# EAGLE design anna-b112-to-dip (EAGLE 9.4.2)
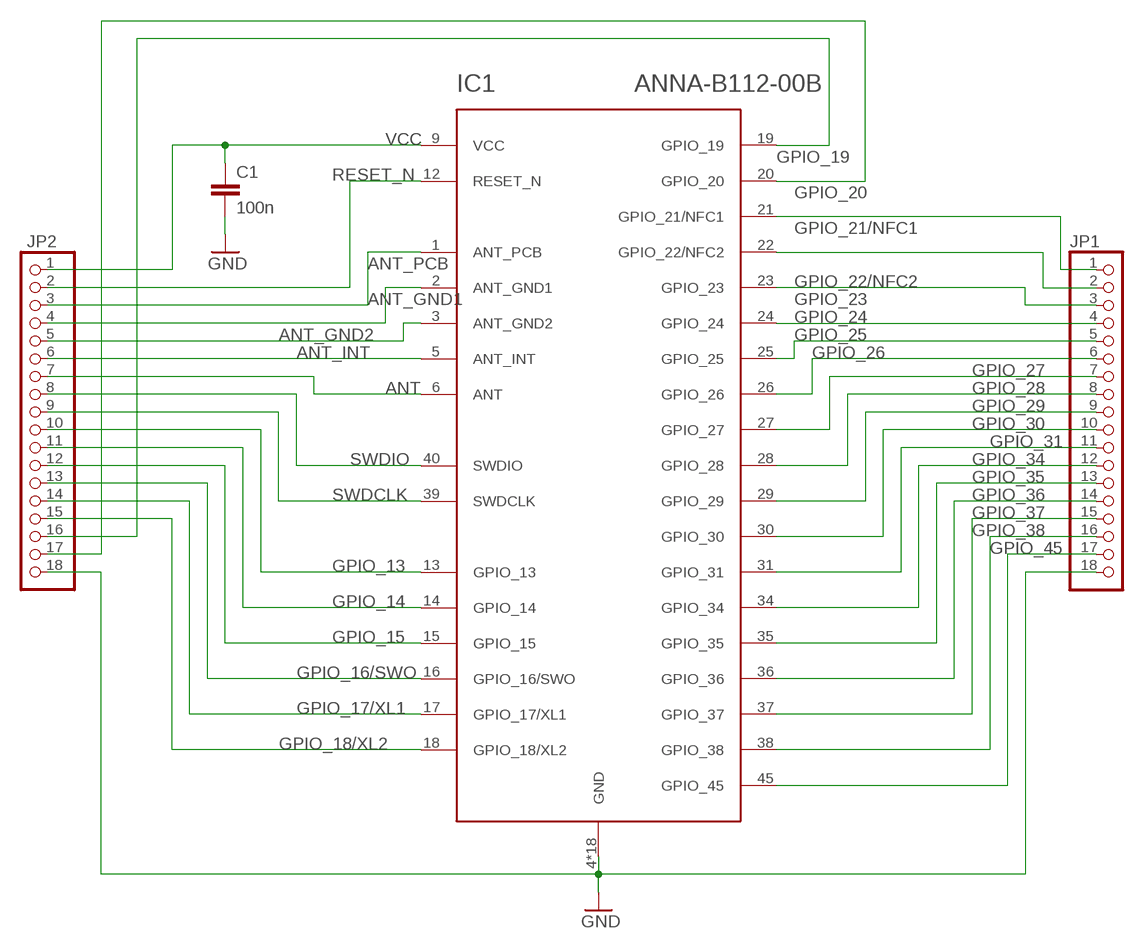
[diagram p0: schematic, sheet 1]

## Parts
C1  100n  C-EUC0805  [C0805]
IC1  ANNA-B112-00B  [ANNA-B112]
JP1  PINHD-1X18  [1X18]
JP2  PINHD-1X18  [1X18]

## Nets
ANT: IC1.6(ANT) JP2.7
ANT_GND1: IC1.2(ANT_GND1) JP2.4
ANT_GND2: IC1.3(ANT_GND2) JP2.5
ANT_INT: IC1.5(ANT_INT) JP2.6
ANT_PCB: IC1.1(ANT_PCB) JP2.3
GND: C1.2 IC1.4(GND) IC1.7(GND) IC1.8(GND) IC1.10(GND) IC1.11(GND) IC1.32(GND) IC1.33(GND) IC1.41(GND) IC1.42(GND) IC1.43(GND) IC1.44(GND) IC1.46(GND) IC1.47(GND) IC1.48(GND) IC1.49(GND) IC1.50(GND) IC1.51(GND) IC1.52(GND) JP1.18 JP2.18
GPIO_13: IC1.13(GPIO_13) JP2.10
GPIO_14: IC1.14(GPIO_14) JP2.11
GPIO_15: IC1.15(GPIO_15) JP2.12
GPIO_16/SWO: IC1.16(GPIO_16/SWO) JP2.13
GPIO_17/XL1: IC1.17(GPIO_17/XL1) JP2.14
GPIO_18/XL2: IC1.18(GPIO_18/XL2) JP2.15
GPIO_19: IC1.19(GPIO_19) JP2.16
GPIO_20: IC1.20(GPIO_20) JP2.17
GPIO_21/NFC1: IC1.21(GPIO_21/NFC1) JP1.1
GPIO_22/NFC2: IC1.22(GPIO_22/NFC2) JP1.2
GPIO_23: IC1.23(GPIO_23) JP1.3
GPIO_24: IC1.24(GPIO_24) JP1.4
GPIO_25: IC1.25(GPIO_25) JP1.5
GPIO_26: IC1.26(GPIO_26) JP1.6
GPIO_27: IC1.27(GPIO_27) JP1.7
GPIO_28: IC1.28(GPIO_28) JP1.8
GPIO_29: IC1.29(GPIO_29) JP1.9
GPIO_30: IC1.30(GPIO_30) JP1.10
GPIO_31: IC1.31(GPIO_31) JP1.11
GPIO_34: IC1.34(GPIO_34) JP1.12
GPIO_35: IC1.35(GPIO_35) JP1.13
GPIO_36: IC1.36(GPIO_36) JP1.14
GPIO_37: IC1.37(GPIO_37) JP1.15
GPIO_38: IC1.38(GPIO_38) JP1.16
GPIO_45: IC1.45(GPIO_45) JP1.17
RESET_N: IC1.12(RESET_N) JP2.2
SWDCLK: IC1.39(SWDCLK) JP2.9
SWDIO: IC1.40(SWDIO) JP2.8
VCC: C1.1 IC1.9(VCC) JP2.1

## Library data of the parts
C1 = resistor:C-EU: CAPACITOR, European symbol
IC1 = custom-library:ANNA-B112-00B: u-blox ANNA-B112-00B
JP1 JP2 = pinhead:PINHD-1X18: PIN HEADER

## Board
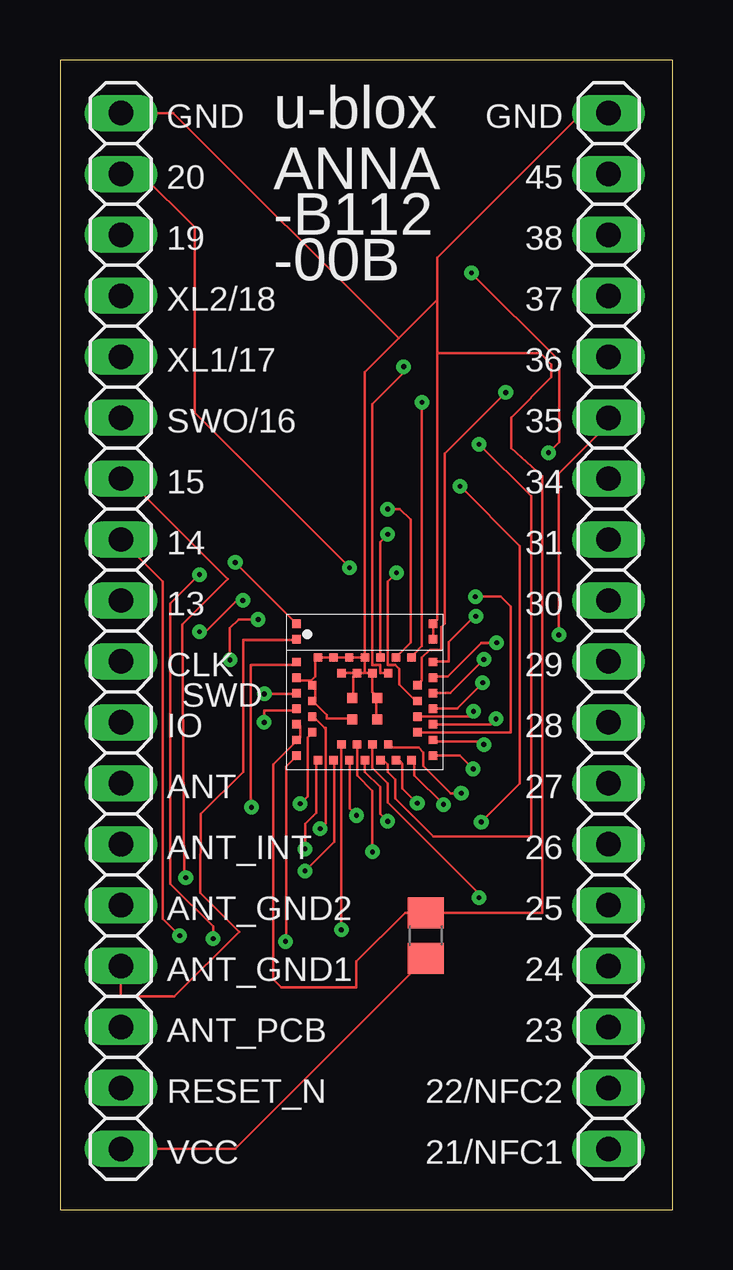
[diagram p1: board, top side]
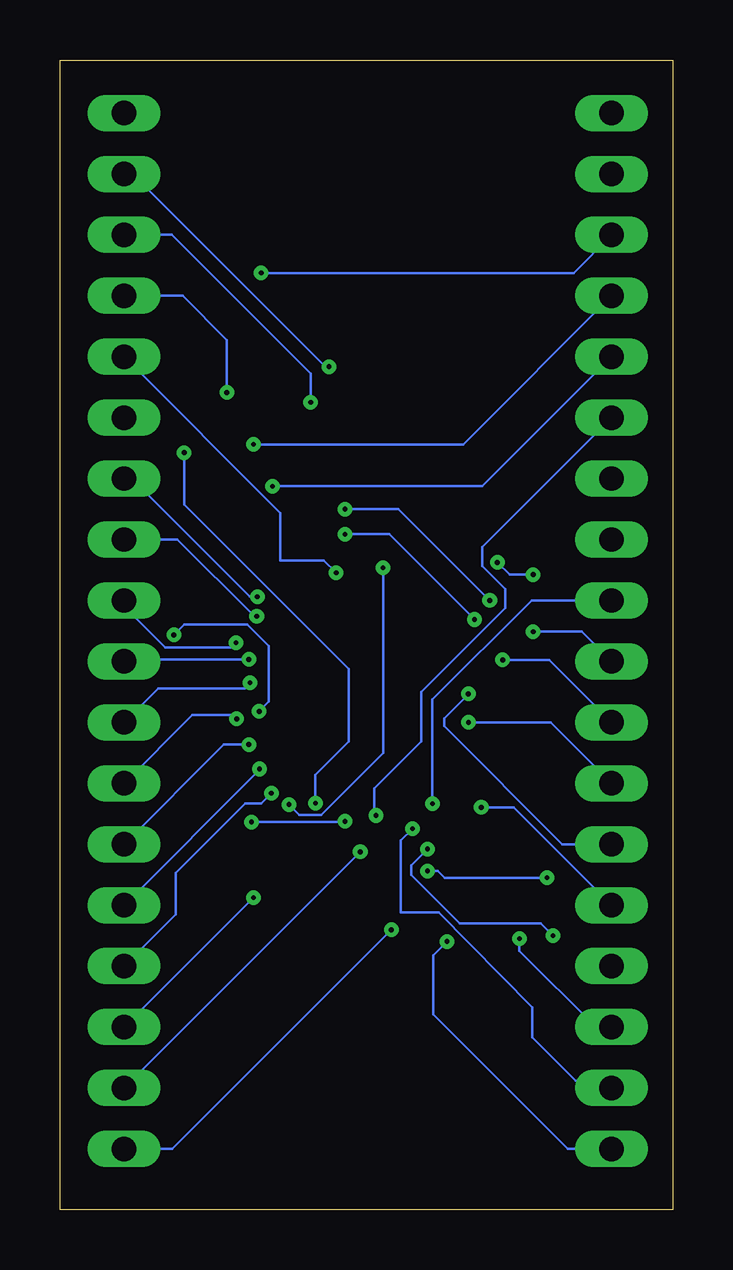
[diagram p2: board, bottom side, seen from below]

Size 25.53 x 47.93 mm. Coordinates in mm from the lower left corner, seen from the top.
Outline: 0,0 25.53,0 25.53,47.93 0,47.93 0,0
Copper layers (1*16): Top 0.035mm / dielectric 1.5mm / Bottom 0.035mm
Design rules "default *": minimum track width 4mil, minimum drill 0.2mm, track to track 6mil, track to pad 3mil, pad to pad 6mil, via to via 6mil, smd to smd 6mil, copper to edge 40mil, drill to drill 4mil, minimum pad ring 10mil, minimum via ring 8mil, stop-mask expansion 4mil, vias tented up to drill 0mil, thermal gap 10mil

### Footprints (pad centres in the part's own frame; a part is rotated, then mirrored left to right if it is on the bottom)
C0805 = smd 1.3 x 1.5: 1 -0.95,0; 2 0.95,0
ANNA-B112 = smd 0.35 x 0.35: 1 -2.84,2.84; 2 -2.84,2.19; 3 -2.84,1.248; 4 -2.84,0.598; 5 -2.84,-0.052; 6 -2.84,-0.702; 7 -2.84,-1.352; 8 -2.84,-2.002; 9 -2.84,-2.652; 10 -2.19,0.273; 11 -2.19,-0.377; 12 -2.19,-1.027; 13 -2.19,-1.677; 14 -1.95,-2.84; 15 -1.3,-2.84; 16 -0.65,-2.84; 17 0,-2.84; 18 0.65,-2.84; 19 1.3,-2.84; 20 1.95,-2.84; 21 -0.975,-2.19; 22 -0.325,-2.19; 23 0.325,-2.19; 24 0.975,-2.19; 25 2.84,-2.652; 26 2.84,-2.002; 27 2.84,-1.352; 28 2.84,-0.702; 29 2.84,-0.052; 30 2.84,0.598; 31 2.84,1.248; 32 2.84,2.19; 33 2.84,2.84; 34 2.19,-1.677; 35 2.19,-1.027; 36 2.19,-0.377; 37 2.19,0.273; 38 1.95,1.435; 39 1.3,1.435; 40 0.65,1.435; 41 0,1.435; 42 -0.65,1.435; 43 -1.3,1.435; 44 -1.95,1.435; 45 0.975,0.785; 46 0.325,0.785; 47 -0.325,0.785; 48 -0.975,0.785 | smd 0.42 x 0.42: 49 -0.52,-0.252; 50 -0.52,-1.152; 51 0.52,-1.152; 52 0.52,-0.252
1X18 = drill 1.016 long: 1 -21.59,0; 2 -19.05,0; 3 -16.51,0; 4 -13.97,0; 5 -11.43,0; 6 -8.89,0; 7 -6.35,0; 8 -3.81,0; 9 -1.27,0; 10 1.27,0; 11 3.81,0; 12 6.35,0; 13 8.89,0; 14 11.43,0; 15 13.97,0; 16 16.51,0; 17 19.05,0; 18 21.59,0

### Placement (x,y rotation side)
C1  15.24,11.43 90 top
IC1  12.7,21.59 0 top
JP1  22.86,24.13 90 top
JP2  2.54,24.13 90 top

### Tracks (layer width: path | path; a pad name or v marks a point on that pad's centre or on a via)
ANT  (via drill 0.2)
  Top 0.102: v8.51,20.32 8.51,20.82 9.85,20.82 IC1.6
  Bottom 0.102: v8.51,20.32 5.08,20.32 JP2.7
ANT_GND1
  Top 0.102: IC1.2 9.84,23.75 7.63,23.75 7.63,18.26 5.87,16.51 5.84,13.21 7.46,11.59 4.76,8.89 2.54,8.89 JP2.4
ANT_GND2  (via drill 0.2)
  Top 0.102: v7.98,16.78 7.95,16.8 7.95,22.7 9.84,22.7 IC1.3
  Bottom 0.102: v7.98,16.78 6.62,16.78 JP2.5
ANT_INT  (via drill 0.2)
  Top 0.102: v8.52,21.51 9.86,21.51 IC1.5
  Bottom 0.102: v8.52,21.51 8.51,21.5 9.53,20.48 9.53,20.16 4.6,15.24 JP2.6
ANT_PCB  (via drill 0.2)
  Top 0.102: v7.3,26.99 IC1.1 | v5.81,26.48 4.6,25.27 4.6,13.59 6.38,11.81 v6.38,11.3
  Bottom 0.102: v7.3,26.99 6.79,26.48 v5.81,26.48 | v6.38,11.3 6.38,10.79 3.21,7.62 JP2.3
GND
  Top 0.102: IC1.7 10,20.16 10,19.68 IC1.8 9.84,19.53 8.89,18.57 8.89,9.61 9.21,9.28 12.35,9.28 12.35,10.35 14.38,12.38 C1.2 20.1,12.38 20.1,30.59 18.8,31.75 18.8,33.02 20.48,34.7 20.48,35.24 20,35.72 15.72,35.72 | 10.48,22.07 10,22.07 IC1.4 | 10.48,22.07 10.48,21.91 IC1.10 10.64,21.75 10.64,21.27 IC1.11 10.64,21.11 11.11,20.64 11.11,20.48 12.06,20.48 IC1.50 | IC1.41 12.06,23.02 IC1.42 11.91,23.02 11.43,23.02 IC1.43 11.27,23.02 10.79,23.02 IC1.44 10.64,23.02 10.64,22.23 10.48,22.07 | IC1.51 13.18,20.48 13.18,21.27 IC1.52 13.18,21.43 13.02,21.59 13.02,22.23 IC1.46 12.7,22.38 | IC1.48 11.75,22.38 12.22,22.38 IC1.47 | 12.7,22.38 IC1.47 | IC1.49 12.22,21.43 12.22,22.23 IC1.47 | 12.7,22.38 IC1.41 | IC1.41 12.7,34.92 14.11,36.34 | IC1.32 15.56,23.81 15.56,24.29 IC1.33 15.72,24.61 15.72,35.72 | 15.72,37.94 15.72,39.69 21.74,45.72 JP1.18 | 15.72,37.94 15.72,35.72 | 15.72,37.94 14.11,36.34 | 14.11,36.34 4.72,45.72 JP2.18
GPIO_13  (via drill 0.2)
  Top 0.102: v10.01,16.93 10.32,17.24 10.32,19.68 10.48,19.84 IC1.13
  Bottom 0.102: v10.01,16.93 10.01,21.27 5.87,25.4 JP2.10
GPIO_14  (via drill 0.2)
  Top 0.102: IC1.14 10.67,18.67 10.67,16.54 10.21,16.09 v10.21,15.04 | v4.99,11.43 4.29,12.13 4.29,26.19 JP2.11
  Bottom 0.102: v10.21,15.04 10.9,14.36 10.9,13.96 8.87,11.94 5.49,11.94 v4.99,11.43
GPIO_15  (via drill 0.2)
  Top 0.102: v10.21,14.12 11.43,15.34 11.43,18.73 IC1.15 | v5.24,13.84 5.17,13.91 5.09,24.4 6.99,26.29 2.79,30.48 JP2.12
  Bottom 0.102: v10.21,14.12 9.78,14.12 9.5,13.84 v5.24,13.84
GPIO_16/SWO  (via drill 0.2)
  Top 0.102: v12.36,16.44 12.06,16.73 12.06,18.73 IC1.16
  Bottom 0.102: v12.36,16.44 12.43,16.52 12.43,17.57 10.48,19.53 10.48,21.59 6.99,25.08 6.99,25.88 7.94,26.83 7.94,27.62 JP2.13
GPIO_17/XL1  (via drill 0.2)
  Top 0.102: IC1.17 12.7,18.26 13.34,17.62 13.34,16.51 v13.65,16.19 | v17.55,16.17 19.16,17.77 19.16,27.67 v16.67,30.16
  Bottom 0.102: v17.55,16.17 13.68,16.17 v13.65,16.19 | v16.67,30.16 7.94,30.16 JP2.14
GPIO_18/XL2  (via drill 0.2)
  Top 0.102: v17.46,31.91 19.63,29.74 19.63,15.56 15.56,15.56 13.97,17.14 13.97,17.94 13.65,18.26 13.65,18.57 13.49,18.73 IC1.18
  Bottom 0.102: v17.46,31.91 8.73,31.91 JP2.15
GPIO_19  (via drill 0.2)
  Top 0.102: v14.88,16.95 14.27,17.56 14.27,18.59 14.13,18.73 IC1.19 | v20.35,31.56 20.8,32 20.8,35.4 v17.14,39.05
  Bottom 0.102: v14.88,16.95 14.88,18.14 13.49,19.53 13.49,22.54 20.35,29.4 v20.35,31.56 | v17.14,39.05 4.13,39.05 JP2.16
GPIO_20  (via drill 0.2)
  Top 0.102: v15.98,16.9 14.76,18.12 14.76,18.73 IC1.20 | v12.06,26.77 5.61,33.22 5.61,40.95 3.38,43.18 JP2.17
  Bottom 0.102: v15.98,16.9 15.55,16.47 14.65,16.47 12.06,19.05 v12.06,26.77
GPIO_21/NFC1  (via drill 0.2)
  Top 0.102: IC1.21 v11.72,11.67
  Bottom 0.102: JP1.1 20.85,2.54 v11.72,11.67
GPIO_22/NFC2  (via drill 0.2)
  Top 0.102: v13.02,14.92 13.02,17.46 12.38,18.1 12.38,19.37 IC1.22
  Bottom 0.102: JP1.2 v13.02,14.92
GPIO_23  (via drill 0.2)
  Top 0.102: v17.46,13.02 17.46,13.18 13.65,16.99 13.65,17.78 13.02,18.41 13.02,19.37 IC1.23
  Bottom 0.102: JP1.3 v17.46,13.02
GPIO_24  (via drill 0.2)
  Top 0.102: IC1.24 13.8,19.27 14.95,19.27 15.14,19.07 15.14,18.51 16.29,17.37 v16.72,17.37
  Bottom 0.102: v16.72,17.37 17.15,16.93 17.8,16.93 20.7,14.04 20.7,12.32 JP1.4
GPIO_25  (via drill 0.2)
  Top 0.102: v17.21,18.38 16.65,18.94 IC1.25
  Bottom 0.102: v17.21,18.38 17.21,18.34 JP1.5
GPIO_26  (via drill 0.2)
  Top 0.102: v17.66,19.39 17.66,19.53 15.56,19.53 IC1.26
  Bottom 0.102: v17.66,19.39 18.71,19.39 JP1.6
GPIO_27  (via drill 0.2)
  Top 0.102: v18.17,20.47 17.94,20.24 IC1.27
  Bottom 0.102: v18.17,20.47 18.32,20.62 20.02,20.62 JP1.7
GPIO_28  (via drill 0.2)
  Top 0.102: v17.61,21.97 16.54,20.9 15.59,20.9 15.56,20.91 IC1.28
  Bottom 0.102: v17.61,21.97 17.84,21.74 21.44,21.74 JP1.8
GPIO_29  (via drill 0.2)
  Top 0.102: v17.66,22.94 16.26,21.55 16.26,21.54 IC1.29
  Bottom 0.102: JP1.9 22.78,22.94 v17.66,22.94
GPIO_30  (via drill 0.2)
  Top 0.102: v18.19,23.64 17.56,23.64 16.15,22.23 15.56,22.23 IC1.30
  Bottom 0.102: v18.19,23.64 18.4,23.43 21.14,23.43 22.86,25.15 JP1.10
GPIO_31  (via drill 0.2)
  Top 0.102: v17.33,24.75 17.28,24.75 16.19,23.66 16.19,22.86 15.56,22.86 IC1.31
  Bottom 0.102: v17.33,24.75 17.44,24.75 20.64,27.94 JP1.11
GPIO_34  (via drill 0.2)
  Top 0.102: v17.3,25.56 18.37,25.56 18.78,25.15 18.78,19.9 IC1.34
  Bottom 0.102: v17.3,25.56 17.62,25.56 22.54,30.48 JP1.12
GPIO_35  (via drill 0.2)
  Top 0.102: v17.23,20.78 17.02,20.57 14.9,20.57 IC1.35 | v20.78,23.96 20.78,30.69 22.86,32.77 JP1.13
  Bottom 0.102: v17.23,20.78 16.82,21.18 16.82,23.5 17.72,24.4 20.35,24.4 v20.78,23.96
GPIO_36  (via drill 0.2)
  Top 0.102: v14.02,26.56 13.65,26.19 13.65,22.7 13.97,22.7 14.13,22.54 14.13,21.91 14.76,21.27 IC1.36
  Bottom 0.102: v14.02,26.56 14.53,27.06 16.35,27.06 16.35,29.05 JP1.14
GPIO_37  (via drill 0.2)
  Top 0.102: v18.57,34.07 16.03,31.53 16.03,24.45 15.88,24.29 15.88,23.34 15.4,23.34 15.08,23.02 15.08,22.07 14.92,21.91 IC1.37
  Bottom 0.102: JP1.15 20.42,38.1 18.57,36.25 v18.57,34.07
GPIO_38  (via drill 0.2)
  Top 0.102: v15.08,33.66 15.08,23.5 14.76,23.18 IC1.38
  Bottom 0.102: v15.08,33.66 15.08,34.85 20.87,40.64 JP1.16
GPIO_45  (via drill 0.2)
  Top 0.102: v14.32,35.15 14.32,34.89 13.02,33.59 13.02,22.7 13.34,22.7 13.34,22.38 13.65,22.38 IC1.45
  Bottom 0.102: JP1.17 22.5,43.18 14.47,35.15 v14.32,35.15
RESET_N  (via drill 0.2)
  Top 0.102: v10.84,15.89 11.07,16.12 11.07,20.08 11.04,20.08 10.64,20.48 IC1.12
  Bottom 0.102: v10.84,15.89 11.32,15.41 11.33,12.39 9.75,12.39 5.84,8.43 5.84,7.19 4.04,5.38 2.59,5.38 2.54,5.33 JP2.2
SWDCLK  (via drill 0.2)
  Top 0.102: v13.65,29.21 14.16,29.21 14.61,28.77 14.61,23.65 14.13,23.18 IC1.39 | v5.81,24.1 6.06,24.1 7.37,25.4 v7.62,25.4
  Bottom 0.102: v13.65,29.21 11.43,29.21 v7.62,25.4 | v5.81,24.1 3.78,24.1 JP2.9
SWDIO  (via drill 0.2)
  Top 0.102: v13.65,28.16 13.34,27.84 13.34,23.18 IC1.40 | v8.26,24.61 7.44,24.61 7.08,24.24 v7.08,22.92
  Bottom 0.102: v13.65,28.16 11.81,28.16 v8.26,24.61 | v7.08,22.92 5.14,22.92 JP2.8
VCC  (via drill 0.2)
  Top 0.102: v9.4,11.19 9.42,11.16 9.42,18.47 9.84,18.89 IC1.9 | JP2.1 7.3,2.54 C1.1
  Bottom 0.102: v9.4,11.19 9.98,10.6 9.98,8.15 4.37,2.54 JP2.1

### Text on the board
tPlace: GND | u-blox | GND | 20 | ANNA | 45 | -B112 | 19 | 38 | -00B | XL2/18 | 37 | XL1/17 | 36 | SWO/16 | 35 | 15 | 34 | 14 | 31 | 13 | 30 | CLK | 29 | SWD | IO | 28 | ANT | 27 | ANT_INT | 26 | ANT_GND2 | 25 | ANT_GND1 | 24 | ANT_PCB | 23 | RESET_N | 22/NFC2 | VCC | 21/NFC1